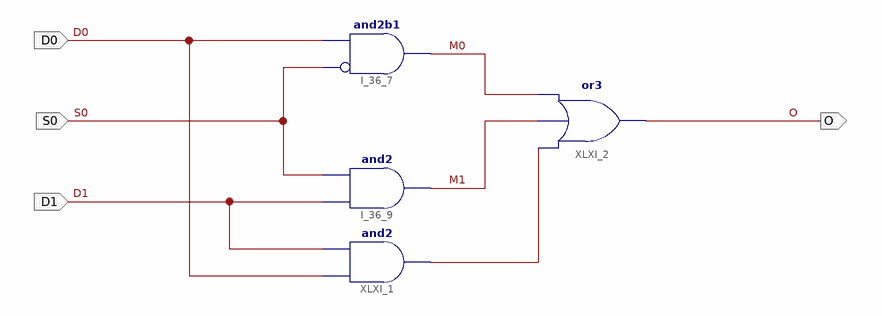
[diagram p0: schematic sheet 1]
// Xilinx ISE schematic mx2_1.sch (spartan3e) as structural Verilog: 4 symbols, 4 ports
module mx2_1 (
  input  D0,
  input  D1,
  input  S0,
  output O
);

  wire M0, M1, XLXN_1;

  and I_36_9 (M1, D1, S0);
  and I_36_7 (M0, ~S0, D0);  // and2b1
  and XLXI_1 (XLXN_1, D0, D1);
  or XLXI_2 (O, XLXN_1, M1, M0);
endmodule
